# EAGLE design rw-pd1b (EAGLE 6.5.0)
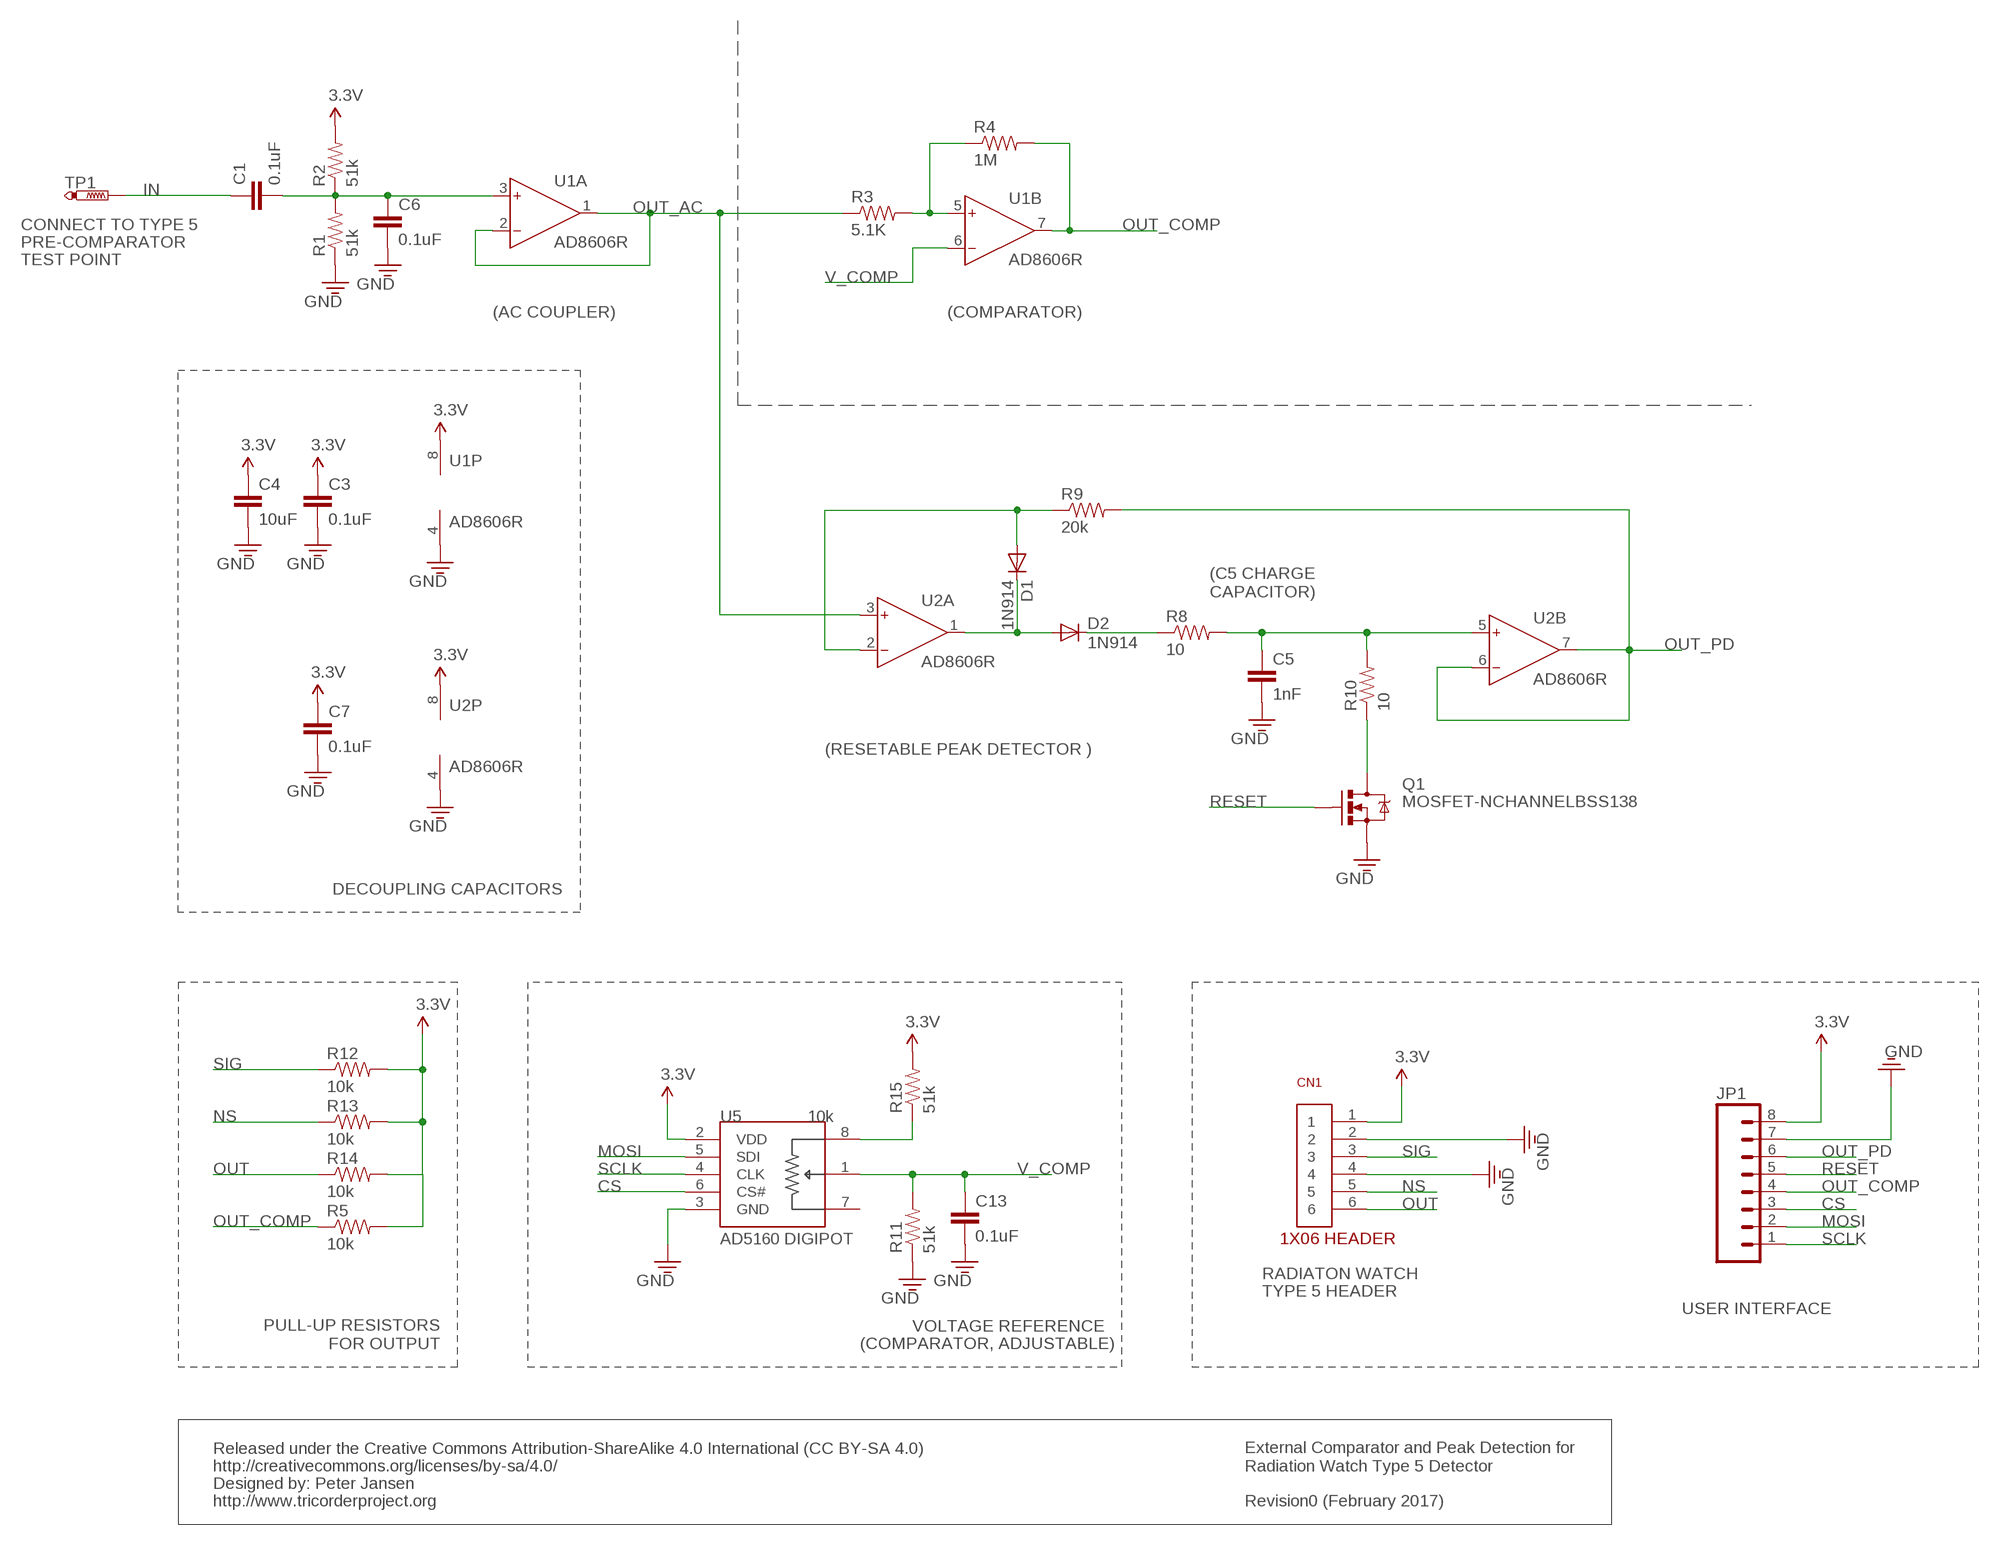
[diagram p0: schematic, sheet 1]

## Parts
C1  0.1uF  CAP0603  [0603]
C3  0.1uF  CAP0603  [0603]
C4  10uF  CAP0603  [0603]
C5  1nF  CAP0603  [0603]
C6  0.1uF  CAP0603  [0603]
C7  0.1uF  CAP0603  [0603]
C13  0.1uF  CAP0603  [0603]
CN1  1X06  [1X06]
D1  1N914  DIODESOD  [SOD-323]
D2  1N914  DIODESOD  [SOD-323]
JP1  M08LOCK  [1X08_LOCK]
Q1  MOSFET-NCHANNELBSS138  [SOT23]
R1  51k  RESISTOR0603  [0603]
R2  51k  RESISTOR0603  [0603]
R3  5.1K  RESISTOR0603  [0603]
R4  1M  RESISTOR0603  [0603]
R5  10k  RESISTOR0603  [0603]
R8  10  RESISTOR0603  [0603]
R9  20k  RESISTOR0603  [0603]
R10  10  RESISTOR0603  [0603]
R11  51k  RESISTOR0603  [0603]
R12  10k  RESISTOR0603  [0603]
R13  10k  RESISTOR0603  [0603]
R14  10k  RESISTOR0603  [0603]
R15  51k  RESISTOR0603  [0603]
TP1  PTR1PAD1-13  [P1-13]
U1  AD8606R  AD8607R  [SO8]
U2  AD8606R  AD8607R  [SO8]
U5  10k  AD5160  [SOT-23-8]

## Nets
3.3V: C3.1 C4.1 C7.1 CN1.1 JP1.8 R2.2 R5.2 R12.2 R13.2 R14.2 R15.2 U1.8(P:V+) U2.8(P:V+) U5.2(VDD)
CS: JP1.3 U5.6(CS#)
GND: C3.2 C4.2 C5.2 C6.2 C7.2 C13.2 CN1.2 CN1.4 JP1.7 Q1.2(S) R1.1 R11.1 U1.4(P:V-) U2.4(P:V-) U5.3(GND)
IN: C1.1 TP1.TP
MOSI: JP1.2 U5.5(SDI)
N$2: C1.2 C6.1 R1.2 R2.1 U1.3(A:IN+)
N$4: R3.2 R4.1 U1.5(B:IN+)
N$7: D1.A R9.1 U2.2(A:IN-)
N$9: D1.C D2.A U2.1(A:OUT)
N$10: D2.C R8.1
N$11: C5.1 R8.2 R10.2 U2.5(B:IN+)
N$13: Q1.3(D) R10.1
N$17: R15.1 U5.8(A)
NS: CN1.5 R13.1
OUT: CN1.6 R14.1
OUT_AC: R3.1 U1.1(A:OUT) U1.2(A:IN-) U2.3(A:IN+)
OUT_COMP: JP1.4 R4.2 R5.1 U1.7(B:OUT)
OUT_PD: JP1.6 R9.2 U2.6(B:IN-) U2.7(B:OUT)
RESET: JP1.5 Q1.1(G)
SCLK: JP1.1 U5.4(CLK)
SIG: CN1.3 R12.1
V_COMP: C13.1 R11.2 U1.6(B:IN-) U5.1(W)
Unconnected: U5.7(B)

## Notes on the sheet
- CONNECT TO TYPE 5
- PRE-COMPARATOR
- TEST POINT
- (AC COUPLER) | (COMPARATOR)
- (C5 CHARGE
  CAPACITOR)
- (RESETABLE PEAK DETECTOR )
- DECOUPLING CAPACITORS
- RADIATON WATCH
- TYPE 5 HEADER
- USER INTERFACE
- VOLTAGE REFERENCE
- PULL-UP RESISTORS
  FOR OUTPUT
- (COMPARATOR, ADJUSTABLE)
- Released under the Creative Commons Attribution-ShareAlike 4.0 International (CC BY-SA 4.0)
- http://creativecommons.org/licenses/by-sa/4.0/
- External Comparator and Peak Detection for
  Radiation Watch Type 5 Detector
- Designed by: Peter Jansen
- http://www.tricorderproject.org | Revision0 (February 2017)

## Library data of the parts
C1 C3-C7 = arm:CAP: Capacitor Standard 0603 ceramic capacitor, and 0.1" leaded capacitor.
C13 = openct:CAP: Capacitor Standard 0603 ceramic capacitor, and 0.1" leaded capacitor.
CN1 = arm:1X06
D1 D2 = SparkFun-DiscreteSemi:DIODE: Diode These are standard reverse protection diodes and small signal diodes. SMA package can handle up to about 1A. SOD-323 can handle about 200mA. What the SOD-323 package when ordering, there are some mfgs out there that are 5-pin packages.; PROD_ID: DIO-09646
JP1 = SparkFun-Connectors:M08: Header 8 Standard 8-pin 0.1" header. Use with straight break away headers (SKU : PRT-00116), right angle break away headers (PRT-00553), swiss pins (PRT-00743), machine pins (PRT-00117), and female headers (PRT-00115).
Q1 = SparkFun-DiscreteSemi:MOSFET-NCHANNEL: Common NMOSFET Parts MFG P/N Store ID Prod ID FDD8780 TRANS-09984 SI7820DN TRANS-11055 FDS6630A IC-08089 2N7002PW TRANS-11151 FQP30N06L COM-10213 TRANS-10060 BSS123LT1G TRANS-08345 BSS138 TRANS-00830 BS170 2N7000; PROD_ID: TRANS-00830
R1-R5 R8-R10 R12-R14 = arm:RESISTOR: Resistor Basic schematic elements and footprints for 0603, 1206, and PTH 1/10th watt (small) resistors.
R11 R15 = openct:RESISTOR: Resistor Basic schematic elements and footprints for 0603, 1206, and PTH 1/10th watt (small) resistors.
TP1 = testpad:PTR1: TEST PIN
U1 U2 = analog-devices:AD8607: Precision Micropower, Low Noise CMOS, Rail-to-Rail Input/Output Operational Amplifiers Source: http://www.analog.com/static/imported-files/data_sheets/AD8603_8607_8609.pdf; MPN: AD8607ARMZ-R2; OC_FARNELL: 1651293; OC_NEWARK: 19M8927
U5 = openct:AD5160: AD5160 Digipot (256-Position, SPI-Compatible)

## Board
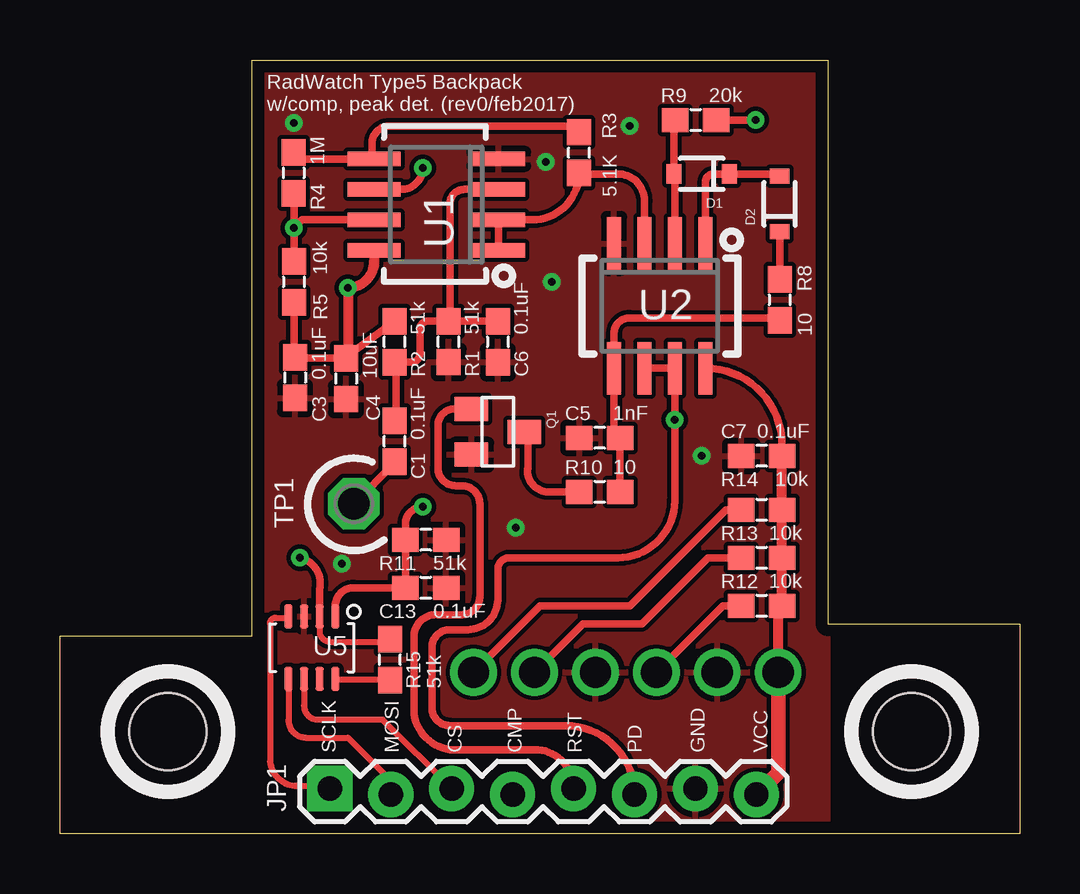
[diagram p1: board, top side]
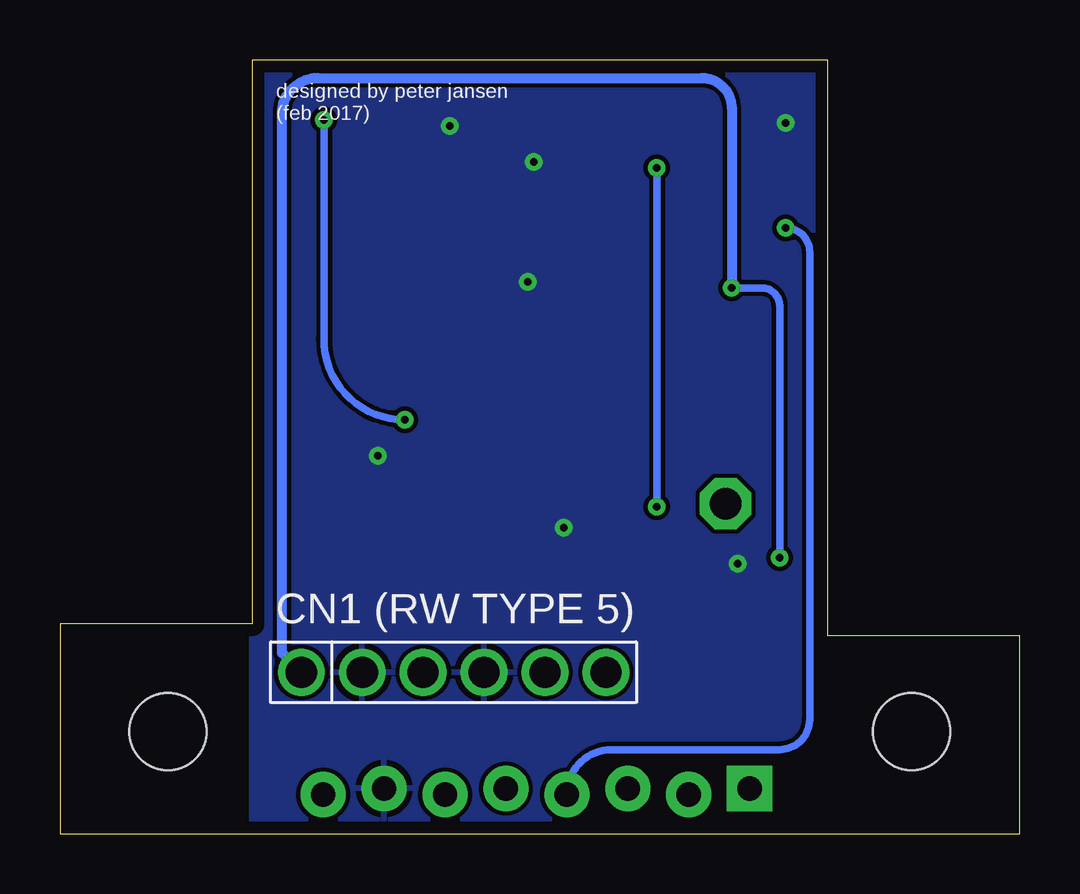
[diagram p2: board, bottom side, seen from below]

Size 40 x 32.25 mm. Coordinates in mm from the lower left corner, seen from the top.
Outline: 0,0 0,8.25 8,8.25 8,32.25 32,32.25 32,8.75 40,8.75 40,0 0,0
Copper layers (1*16): Top 0.035mm / dielectric 1.5mm / Bottom 0.035mm
Design rules "default *": minimum track width 8mil, minimum drill 13mil, track to track 7mil, track to pad 7mil, pad to pad 7mil, via to via 7mil, smd to smd 7mil, copper to edge 20mil, drill to drill 8mil, minimum pad ring 10mil, minimum via ring 8mil, stop-mask expansion 4mil, vias tented up to drill 0mil, thermal gap 10mil
Holes 3.2 mm at 4.5,4.25 35.5,4.25

### Footprints (pad centres in the part's own frame; a part is rotated, then mirrored left to right if it is on the bottom)
0603 = smd 1.1 x 1: 1 -0.85,0; 2 0.85,0
1X06 = drill 1.3: 1 0,0; 2 2.54,0; 3 5.08,0; 4 7.62,0; 5 10.16,0; 6 12.7,0
SOD-323 = smd 0.63 x 0.83: A 1.15,0; C -1.15,0
1X08_LOCK = drill 1.016 pad 1.88 square: 1 0,0.127 | drill 1.016 pad 1.88: 2 2.54,-0.127; 3 5.08,0.127; 4 7.62,-0.127; 5 10.16,0.127; 6 12.7,-0.127; 7 15.24,0.127; 8 17.78,-0.127
SOT23 = smd 1 x 1.4: 1 -0.95,-1.1; 2 0.95,-1.1; 3 0,1.1
P1-13 = drill 1.321 pad 2.159 octagon: TP 0,0
SO8 = smd 0.6 x 2.2: 1 -1.905,-2.6; 2 -0.635,-2.6; 3 0.635,-2.6; 4 1.905,-2.6; 5 1.905,2.6; 6 0.635,2.6; 7 -0.635,2.6; 8 -1.905,2.6
SOT-23-8 = smd 0.35 x 1: 1 -0.975,-1.3; 2 -0.325,-1.3; 3 0.325,-1.3; 4 0.975,-1.3; 5 0.975,1.3; 6 0.325,1.3; 7 -0.325,1.3; 8 -0.975,1.3

### Placement (x,y rotation side)
C1  13.95,16.36 90 top
C3  9.8,19.01 270 top
C4  11.93,18.96 270 top
C5  22.5,16.5 180 top
C6  18.25,20.5 270 top
C7  29.25,15.75 180 top
C13  15.25,10.25 0 top
CN1  29.94,6.72 0 bottom
D1  26.75,27.5 180 top
D2  30,26.25 90 top
JP1  11.25,1.75 0 top
Q1  18.25,16.75 270 top
R1  16.2,20.5 90 top
R2  13.95,20.5 90 top
R3  21.64,28.39 90 top
R4  9.73,27.55 270 top
R5  9.75,23 270 top
R8  30,22.25 270 top
R9  26.5,29.75 0 top
R10  22.5,14.25 0 top
R11  15.25,12.25 180 top
R12  29.25,9.5 0 top
R13  29.25,11.5 0 top
R14  29.25,13.5 0 top
R15  13.75,7.25 90 top
TP1  12.25,13.75 180 top
U1  15.69,26.22 90 top
U2  25,22 180 top
U5  10.5,7.75 180 top

### Tracks (layer width: path | path; a pad name or v marks a point on that pad's centre or on a via)
3.3V  (via drill 0.33)
  Top 0.254: U5.2 10.82,8.43 arc90 11.25,8 13.4,8 arc90 R15.2
  Top 0.305: 13.8,21.5 arc-90 R2.2 11.74,19.75 arc-90 C4.1 9.84,19.82 arc-90 C3.1 arc90 9.88,19.93 arc-90 9.75,20.06 R5.2 | C7.1 30.1,16.2 arc90 U2.8 | U5.2 10.82,10.18 arc90 v10,11.5
  Top 0.406: CN1.1 29.94,9.34 arc-90 R12.2 R13.2 R14.2 C7.1 | C4.1 arc90 12,19.89 v12,22.75 arc90 13.09,23.84 U1.8
  Top 0.61: JP1.8 29.94,2.53 CN1.1
  Bottom 0.305: v10,11.5 10,22 arc-90 10.75,22.75 v12,22.75
  Bottom 0.406: CN1.1 30.75,7.53 30.75,30 arc90 29.25,31.5 13.25,31.5 arc90 12,30.25 v12,22.75
CS
  Top 0.254: U5.6 10.18,5.32 arc90 10.75,4.75 13.46,4.75 JP1.3
GND  (via drill 0.33)
  other vias: 20.25,28 11.75,11.25 19,12.75 20.5,23 23.75,29.5 9.75,29.62 26.75,15.75
  pour Bottom: 8,0 32,0 32,32.25 8,32.25
  pour Top: 8,32.25 8,0 32,0 32,32.25
IN
  Top 0.305: C1.1 13.95,15.45 TP1.TP
MOSI
  Top 0.254: U5.5 9.52,4.72 arc90 10.25,4 12,4 13.79,2.21 JP1.2
N$2
  Top 0.305: 13.8,19.8 arc-90 R2.1 | R2.1 14.65,19.65 arc90 15,20 15,21 arc-90 15.38,21.38 16.18,21.38 arc-90 R1.2 | R1.2 C6.1 arc-90 C6.1 | U1.3 16.86,26.85 arc90 16.25,26.25 16.25,21.41 arc-90 R1.2 | R2.1 arc-90 14,19.6 14,17.51 C1.2 14,17.6
N$4
  Top 0.305: R4.1 10.21,28.12 U1.5 arc-90 13,28.22 13,28.75 arc-90 13.75,29.5 21.38,29.5 R3.2
N$7
  Top 0.305: U2.2 25.63,27.47 arc90 D1.A 25.6,29.7 arc-90 R9.1
N$9
  Top 0.305: U2.1 26.91,27.16 arc-90 27.25,27.5 D1.C 29.9,27.5 arc-90 D2.A
N$10
  Top 0.305: D2.C R8.1
N$11
  Top 0.305: R8.2 arc90 29.9,21.5 23.75,21.5 arc90 23.09,20.84 U2.5 23.09,16.5 arc90 C5.1 R10.2
N$13
  Top 0.305: R10.1 20.25,14.25 arc-90 19.5,15.25 19.5,16.6 arc90 Q1.3
N$17
  Top 0.254: R15.1 11.52,6.4 arc-90 U5.8
NS
  Top 0.305: R13.1 27,11.5 24.25,8.75 21.81,8.75 CN1.5
OUT
  Top 0.305: R14.1 27.75,13.5 23.75,9.5 20.02,9.5 CN1.6
OUT_AC
  Top 0.305: U1.1 U1.2 19.68,25.59 arc90 R3.1 arc90 21.68,27.5 23.25,27.5 arc-90 24.37,26.38 U2.3
OUT_COMP  (via drill 0.33)
  Top 0.305: R5.1 arc-90 9.73,23.86 arc90 9.75,23.88 v9.75,25.25 | U1.7 10.09,25.59 v9.75,25.25 | R4.2 arc-90 9.75,26.68 v9.75,25.25
  Bottom 0.305: v9.75,25.25 arc90 8.75,24.25 8.75,4.75 arc90 10,3.5 17,3.5 arc-90 JP1.4
OUT_PD  (via drill 0.33)
  Top 0.305: U2.6 U2.7 arc90 U2.7 v25.62,17.25 25.62,13.88 arc-90 23.25,11.5 18.75,11.5 arc90 18.25,11 18.25,9.75 arc-90 17,8.5 16.25,8.5 arc90 15.5,7.75 15.5,5.25 arc90 16.25,4.5 21.07,4.5 arc-90 JP1.6 | R9.2 v29,29.75
  Bottom 0.305: v29,29.75 29,20.62 arc-90 v25.62,17.25
RESET
  Top 0.305: Q1.1 16.45,17.7 arc90 15.75,17 15.75,15.25 arc90 16.5,14.5 16.75,14.5 arc-90 17.5,13.75 17.5,9.88 arc-90 16.75,9.12 15.75,9.12 arc90 14.75,8.25 14.75,5 arc90 16.75,3.5 19.79,3.5 arc-90 JP1.5
SCLK
  Top 0.254: JP1.1 arc90 11.13,2 10,2 arc-90 8.75,3 8.75,8.75 arc-90 9,9 9.48,9 arc90 U5.4
SIG
  Top 0.305: R12.1 27.64,9.5 CN1.3
V_COMP  (via drill 0.33)
  Top 0.305: U1.6 14.23,26.85 arc90 v15.12,27.75 | U5.1 11.48,9.48 arc-90 12.25,10.25 C13.1 R11.2 14.4,12.9 arc-90 v15.12,13.62
  Bottom 0.305: v15.12,27.75 v15.12,13.62

### Text on the board
tPlace: RadWatch Type5 Backpack / w/comp, peak det. (rev0/feb2017) | SCLK | MOSI | CS | CMP | RST | PD | GND | VCC
bPlace: designed by peter jansen / (feb 2017) | CN1 (RW TYPE 5)